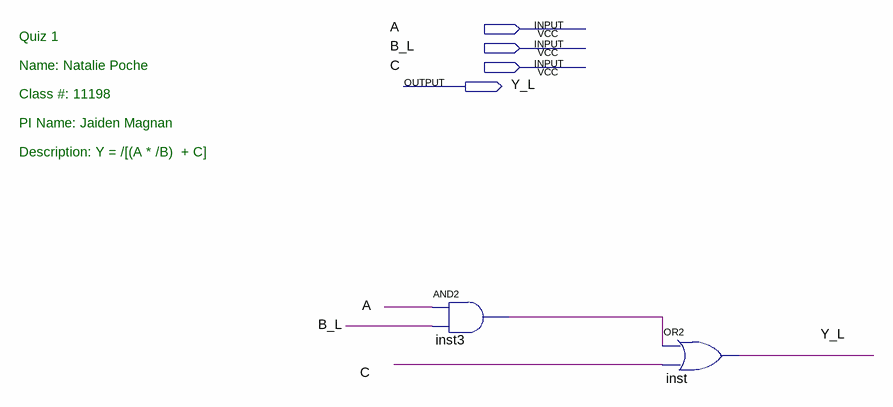
[diagram p0: schematic sheet]
// Quartus schematic quiz1.bdf as structural Verilog: 2 symbols, 4 pins
module quiz1 (
  input  A,
  input  B_L,
  input  C,
  output Y_L
);

  wire inst3_out;

  and inst3 (inst3_out, A, B_L);
  or inst (Y_L, inst3_out, C);

  // Notes on the sheet:
  //   Quiz 1
  //   Name: Natalie Poche
  //   Class #: 11198
  //   PI Name: Jaiden Magnan
  //   Description: Y = /[(A * /B)  + C]
endmodule
